# Altium schematic sheet Pult S1 sch.SchDoc
size A4; DocumentNumber: 1; SheetNumber: 1; SheetTotal: 1; Versija: v1.6; Version: v1.6; ReleaseDate: 2016 06 14; Project: Pult S1
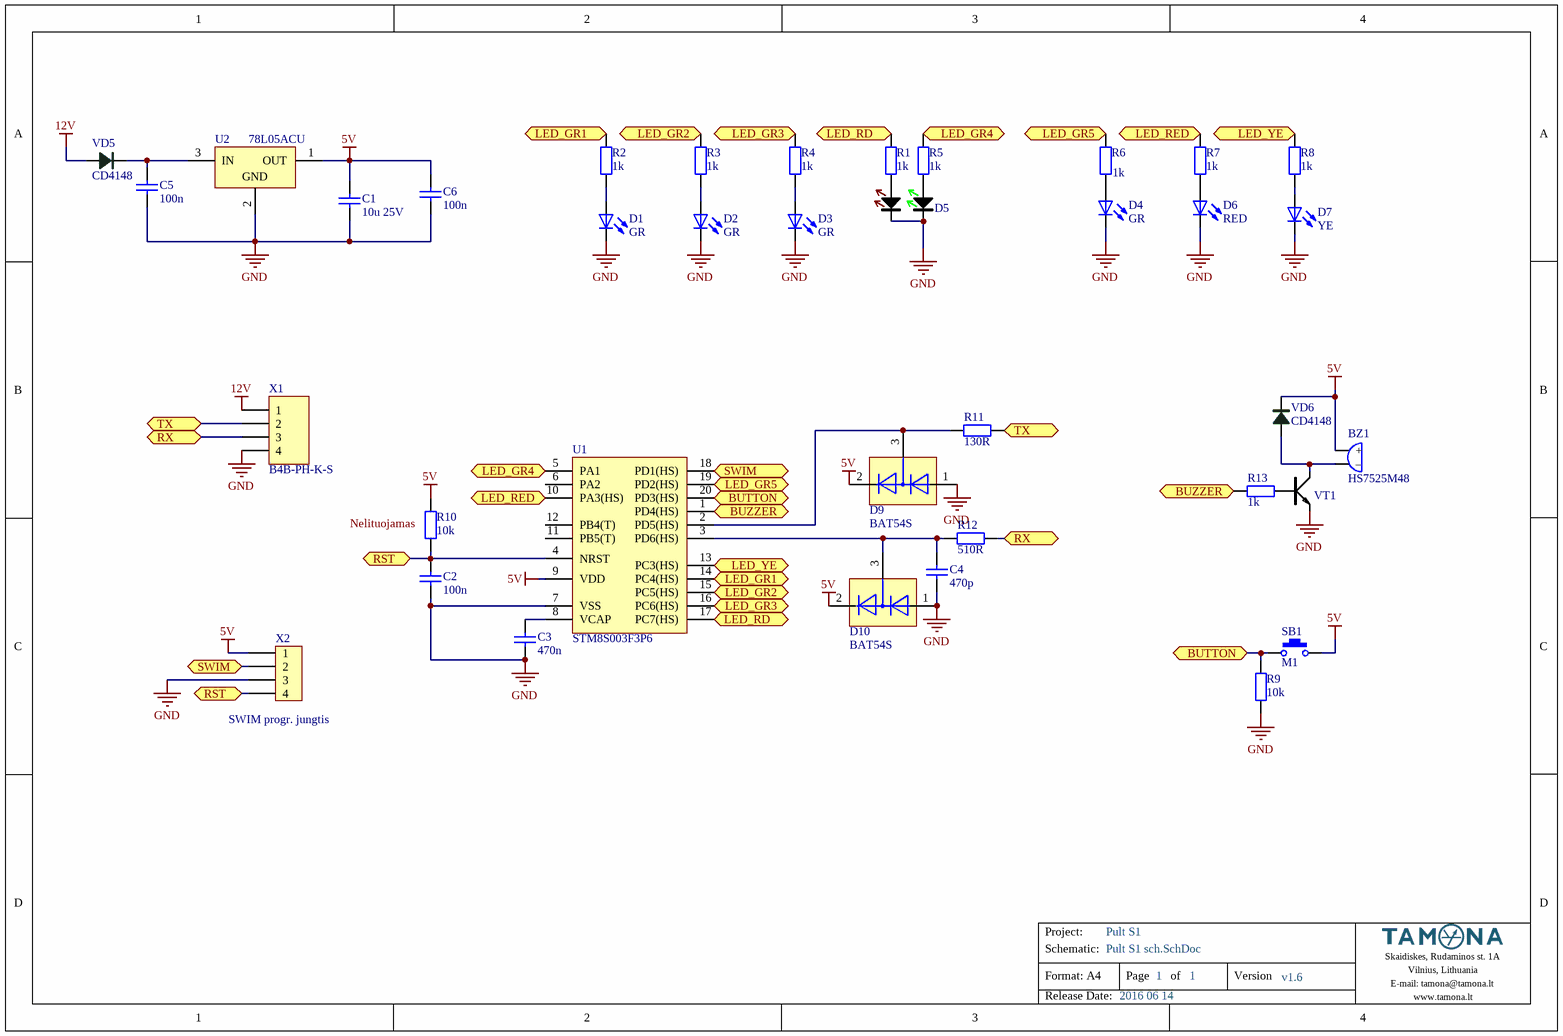
[diagram p0: Pult S1 sch.SchDoc]

## Parts
BZ1  HS7525M48  [BUZER7.6x7.6]
C1  10u 25V  [C_SMD_1206]
C2  100n  [C_SMD_0805_S]
C3  470n  [C_SMD_0805_S]
C4  470p  [C_SMD_0805_S]
C5  100n  [0805 st]
C6  100n  [0805 st]
D1  GR  [LED-0805_S_-GREEN]
D2  GR  [LED-0805_S_-GREEN]
D3  GR  [LED-0805_S_-GREEN]
D4  GR  [LED-0805_S_-GREEN]
D5  KPTB-1612SURKCGKC  [LED 1.6x1.25 RG]  (value not drawn)
D6  RED  [LED-0805_S_-RED]
D7  YE  [LED-0805_S_-YELLOW]
D9  BAT54S  [SOT-23 - BAT54S]
D10  BAT54S  [SOT-23 - BAT54S]
R1  1k  [0805 W]
R2  1k  [R_SMD_0805_S]
R3  1k  [R_SMD_0805_S]
R4  1k  [R_SMD_0805_S]
R5  1k  [R_SMD_0805_S]
R6  1k  [R_SMD_0805_S]
R7  1k  [R_SMD_0805_S]
R8  1k  [R_SMD_0805_S]
R9  10k  [R_SMD_0805_S]
R10  10k  [R_SMD_0805_S]  (no BOM)
R11  130R  [R_SMD_0805_S]
R12  510R  [R_SMD_0805_S]
R13  1k  [0805 W]
SB1  M1  [MYGTUKAS_SMD_TACTILE_6x3.5]
U1  STM8S003F3P6  [TSSOP20_N]
U2  78L05ACU  [SOT89]
VD5  CD4148  [0805 Diode]
VD6  CD4148  [0805 Diode]
VT1  BC817  [SOT23-BCE]  (value not drawn)
X1  B4B-PH-K-S  [JUNG_4k_1x4 kistukas]
X2  SWIM progr. jungtis  [JUNG_4k_1x4_karpoma_kistukas]  (no BOM)

## Ports
BUTTON, BUZZER, LED_GR1, LED_GR2, LED_GR3, LED_GR4, LED_GR5, LED_RD, LED_RED, LED_YE, RST, RX, SWIM, TX

## Nets
5V: BZ1.1(+) C1.2 C6.2 D9.2 D10.2 R10.2 SB1.2 U1.9(VDD) U2.1(OUT) VD6.K X2.1
12V: VD5.A X1.1
GND: C1.1 C2.1 C3.1 C4.1 C5.1 C6.1 D1.K D2.K D3.K D4.K D5.2 D5.4 D6.K D7.K D9.1 D10.1 R9.1 U1.7(VSS) U2.2(GND) VT1.E X1.4 X2.3
BUTTON: R9.2 SB1.1 U1.20(PD3(HS)) ; port BUTTON
BUZZER: R13.1 U1.1(PD4(HS)) ; port BUZZER
LED_GR1: R2.2 U1.14(PC4(HS)) ; port LED_GR1
LED_GR2: R3.2 U1.15(PC5(HS)) ; port LED_GR2
LED_GR3: R4.2 U1.16(PC6(HS)) ; port LED_GR3
LED_GR4: R5.2 U1.5(PA1) ; port LED_GR4
LED_GR5: R6.2 U1.19(PD2(HS)) ; port LED_GR5
LED_RD: R1.2 U1.17(PC7(HS)) ; port LED_RD
LED_RED: R7.2 U1.10(PA3(HS)) ; port LED_RED
LED_YE: R8.2 U1.13(PC3(HS)) ; port LED_YE
RST: C2.2 R10.1 U1.4(NRST) X2.4 ; port RST
RX: R12.2 X1.3 ; port RX
SWIM: U1.18(PD1(HS)) X2.2 ; port SWIM
TX: R11.2 X1.2 ; port TX
NetBZ1_2: BZ1.2(–) VD6.A VT1.C
NetC3_2: C3.2 U1.8(VCAP)
NetC4_2: C4.2 D10.3 R12.1 U1.3(PD6(HS))
NetC5_2: C5.2 U2.3(IN) VD5.K
NetD1_A: D1.A R2.1
NetD2_A: D2.A R3.1
NetD3_A: D3.A R4.1
NetD4_A: D4.A R6.1
NetD5_1: D5.1 R1.1
NetD5_3: D5.3 R5.1
NetD6_A: D6.A R7.1
NetD7_A: D7.A R8.1
NetD9_3: D9.3 R11.1 U1.2(PD5(HS))
NetR13_2: R13.2 VT1.B

Not connected (* = marked no-connect by the designer): BZ1 NC1(NC) NC2(NC); U1 6(PA2) 11(PB5(T)) 12(PB4(T))

## Notes on the sheet
- Labels drawn without touching a wire or pin: Nelituojamas
- Project:
- Schematic:
- Format: A4
- Page       of
- Version
- Skaidiskes, Rudaminos st. 1A
- E-mail: tamona@tamona.lt
- Vilnius, Lithuania
- Release Date:
- www.tamona.lt

## Library data of the parts
BZ1 = Buzzer AD-8505-FQ4-LF: Buzeris; pin to pad: 1>+ 2>- NC1>nc NC2>nc; Aprasymas: 8.5 x 8.5 x 3.0 mm; Voltage 5V; Frequency 3200 Hz; S.P.L. 90 dB; Distance 5 cm; Uzsakymo Nr.: LEMONA; Aprasymas1: ?; Aprasymas2: ?; Aprasymas3: ?; Aprasymas4: ?; Aprasymas5: ?; Nominalas: ?; Pavadinimas: HS7525M48; Footprintas: SMT 7.6x7.6
C1-C6 = Kondensatorius SMD: Aprasymas1: ?; Aprasymas2: ?; Aprasymas3: ?; Aprasymas4: ?; Aprasymas5: ?; Aprasymas: ?; Pavadinimas: ?; Uzsakymo Nr.: ?
  C1: Nominalas: 10u 25V; Footprintas: 1206
  C2 C5 C6: Nominalas: 100n; Footprintas: 0805
  C3: Nominalas: 470n; Footprintas: 0805
  C4: Nominalas: 470p; Footprintas: 0805
D1-D4 D6 D7 = Sviesos diodas SMD 0805: Diodas šviesos SMD; Uzsakymo Nr.: LEMONA; Aprasymas: ?; Nominalas: ?; Aprasymas1: ?; Aprasymas2: ?; Aprasymas3: ?; Aprasymas4: ?; Aprasymas5: ?; Footprintas: 0805
  D1-D4: Pavadinimas: GR
  D6: Pavadinimas: RED
  D7: Pavadinimas: YE
D5 = LEDx2: Diodas šviesos SMD; Footprintas: SMT 1.6x1.25
D9 D10 = Diodas BAT54S: Diodas; Aprasymas: Small Signal Schottky Diodes, Single and Dual; Uzsakymo Nr.: LEMONA; Aprasymas1: ?; Aprasymas2: ?; Aprasymas3: ?; Aprasymas4: ?; Aprasymas5: ?; Nominalas: ?; Pavadinimas: BAT54S; Footprintas: SOT-23
R1-R13 = Resistorius SMD: Aprasymas: ?????; Uzsakymo Nr.: LEMONA; Pavadinimas: ????; Aprasymas1: ?; Aprasymas2: ?; Aprasymas3: ?; Aprasymas4: ?; Aprasymas5: ?; Footprintas: 0805
  R1-R8 R13: Nominalas: 1k
  R9 R10: Nominalas: 10k
  R11: Nominalas: 130R
  R12: Nominalas: 510R
SB1 = Mygtukas SMD: Aprasymas: ?????; Uzsakymo Nr.: LEMONA; Aprasymas1: ?; Aprasymas2: ?; Aprasymas3: ?; Aprasymas4: ?; Aprasymas5: ?; Nominalas: ?; Pavadinimas: M1; Footprintas: SMT
U1 = Mikrovaldiklis STM8S003F3P6: Mikrovaldiklis; Aprasymas: STMICROELECTRONICS  STM8S003F3P6  MCU, 8BIT, STM8, 16MHZ, TSSOP-20; Uzsakymo Nr.: FARNELL 2071020; Aprasymas1: ?; Aprasymas2: ?; Aprasymas3: ?; Aprasymas4: ?; Aprasymas5: ?; Nominalas: ?; Pavadinimas: STM8S003F3P6; Footprintas: TSSOP-20
U2 = Itampos stabilizatorius 78L05ACD: Įtampos stabilizatorius; Aprasymas: Itampos stabilizatorius 78L05ACD SO8; Uzsakymo Nr.: LEMONA 78L05ACU; Aprasymas1: ?; Aprasymas2: ?; Aprasymas3: ?; Aprasymas4: ?; Aprasymas5: ?; Nominalas: ?; Pavadinimas: 78L05ACU; Footprintas: SOT-89
VD5 VD6 = DIODE SMD: Diodas; Footprintas: 0805
VT1 = NPN-GENERIC: Tranzistorius; Footprintas: SOT-23
X1 = Jungtis 4k JST B4B-PH-K-S: Jungtis; Aprasymas: 4WAY, 2MM; Connector Type:Wire to Board; Series:PH; Contact Termination:Through Hole Vertical; Gender:Header; No. of Contacts:4; No. of Rows:1; Pitch Spacing:2mm; Contact Plating:Tin; Contact Material:Brass;; Uzsakymo Nr.: LEMONA 9492437; Nominalas: ?; Aprasymas1: ?; Aprasymas2: ?; Aprasymas3: ?; Aprasymas4: ?; Aprasymas5: ?; Pavadinimas: B4B-PH-K-S; Footprintas: TH; 1x4p; Pitch: 2 mm
X2 = Jungtis 4k karpoma 1x statmena Tevelis: Jungtis; Aprasymas: Kontaktu - kistuku juosta 40kont. 2.54mm tiesi RoHS; Uzsakymo Nr.: LEMONA PL/MO-40S-M; Aprasymas1: ?; Aprasymas2: ?; Aprasymas3: ?; Aprasymas4: ?; Aprasymas5: ?; Nominalas: ?; Pavadinimas: SWIM progr. jungtis; Footprintas: TH; 1x4p; Pitch: 2.54 mm